# EAGLE design main board (EAGLE 7.7.0)
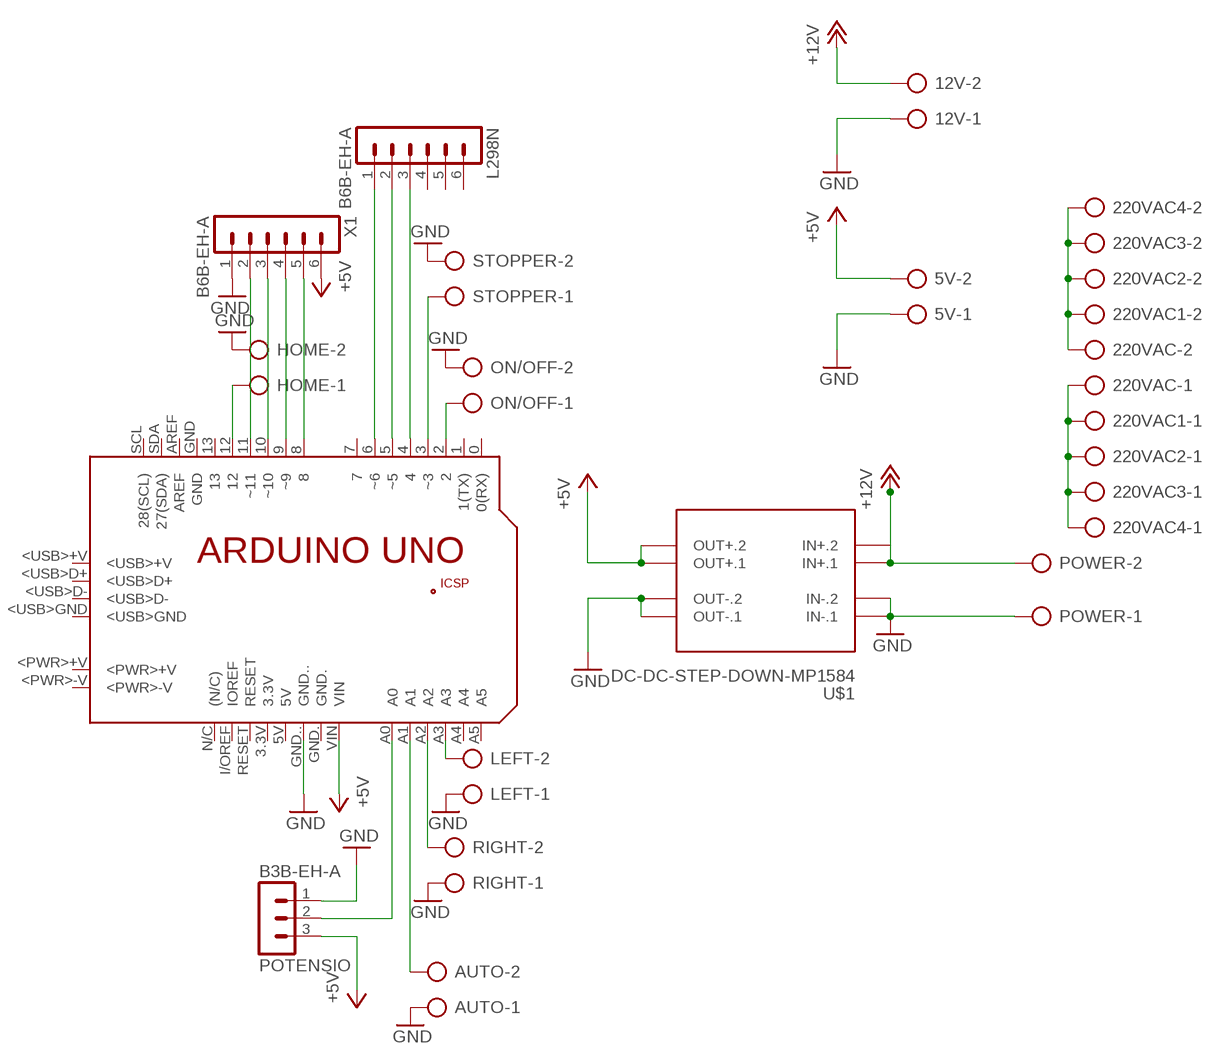
[diagram p0: schematic, sheet 1]

## Parts
5V  AK500/2-H  [AK500/2-H]
12V  AK500/2-H  [AK500/2-H]
220VAC  AK500/2-H  [AK500/2-H]
220VAC1  AK500/2-H  [AK500/2-H]
220VAC2  AK500/2-H  [AK500/2-H]
220VAC3  AK500/2-H  [AK500/2-H]
220VAC4  AK500/2-H  [AK500/2-H]
AUTO  AK500/2-H  [AK500/2-H]
HOME  AK500/2-H  [AK500/2-H]
L298N  B6B-EH-A  [B6B-EH-A]
LEFT  AK500/2-H  [AK500/2-H]
ON/OFF  AK500/2-H  [AK500/2-H]
PCB1  ARDUINO_UNO  [ARDUINO_UNO]
POTENSIO  B3B-EH-A  [B3B-EH-A]
POWER  AK500/2-H  [AK500/2-H]
RIGHT  AK500/2-H  [AK500/2-H]
STOPPER  AK500/2-H  [AK500/2-H]
U$1  DC-DC-STEP-DOWN-MP1584  [DC-DC-STEP-DOWN-MP1584]
X1  B6B-EH-A  [B6B-EH-A]

## Nets
+5V: 5V.2 PCB1.VIN POTENSIO.3 U$1.OUT+.1 U$1.OUT+.2 X1.6
+12V: 12V.2 POWER.2 U$1.IN+.1 U$1.IN+.2
GND: 5V.1 12V.1 AUTO.1 HOME.2 LEFT.1 ON/OFF.2 PCB1.GND.. POTENSIO.1 POWER.1 RIGHT.1 STOPPER.2 U$1.IN-.1 U$1.IN-.2 U$1.OUT-.1 U$1.OUT-.2 X1.1
N$1: L298N.2 PCB1.5(~5)
N$2: L298N.3 PCB1.4
N$3: L298N.1 PCB1.6(~6)
N$4: AUTO.2 PCB1.A1
N$5: PCB1.11(~11) X1.2
N$6: PCB1.A0 POTENSIO.2
N$9: PCB1.10(~10) X1.3
N$10: PCB1.9(~9) X1.4
N$11: PCB1.8 X1.5
N$12: PCB1.A2 RIGHT.2
N$13: LEFT.2 PCB1.A3
N$14: PCB1.3(~3) STOPPER.1
N$15: HOME.1 PCB1.12
N$16: ON/OFF.1 PCB1.2
N$17: 220VAC1.1 220VAC2.1 220VAC3.1 220VAC4.1 220VAC.1
N$18: 220VAC1.2 220VAC2.2 220VAC3.2 220VAC4.2 220VAC.2
Unconnected: L298N.4 L298N.5 L298N.6 PCB1.0(0(RX)) PCB1.1(1(TX)) PCB1.3.3V PCB1.5V PCB1.7 PCB1.13 PCB1.+5V PCB1.<PWR>+V PCB1.<PWR>-V PCB1.<USB>+V PCB1.<USB>D+ PCB1.<USB>D- PCB1.<USB>GND PCB1.A4 PCB1.A5 PCB1.AREF PCB1.GND PCB1.GND. PCB1.GND_ PCB1.I/OREF(IOREF) PCB1.MISO PCB1.MOSI PCB1.N/C((N/C)) PCB1.RESET PCB1.RESET. PCB1.SCK PCB1.SCL(28(SCL)) PCB1.SDA(27(SDA))

## Library data of the parts
5V 12V 220VAC 220VAC1-220VAC4 AUTO HOME LEFT ON/OFF POWER RIGHT STOPPER = con-ptr500:AK500/2-H: CONNECTOR Aug. 2004 / PTR Meßtechnik: Die Bezeichnung der Serie AK505 wurde geändert. Es handelt sich hierbei um AK500 in horizontaler Ausführung.; OC_FARNELL: unknown; OC_NEWARK: unknown
L298N X1 = con-JST EH:B6B-EH: JST EH series header 2.50mm pitch disconnectable crimp style connectors, vertical (side entry type), 6 pins
PCB1 = arduino:ARDUINO_UNO: Device for representing an Arduino Uno board with a footprint in an EAGLE design. Created by Dave Young for Element14. More EAGLE documentation at: http://www.element14.com/community/community/knode/cadsoft_eagle
POTENSIO = con-JST EH:B3B-EH: JST EH series header 2.50mm pitch disconnectable crimp style connectors, vertical (side entry type), 3 pins
U$1 = diy-modules:DC-DC-STEP-DOWN-MP1584: DC/DC Step-Down Regulator based on MP1584 chip MP1584 datasheet available here: http://www.haoyuelectronics.com/Attachment/MP1584/MP1584.pdf Click here to find device on ebay.com <http://www.ebay.com/sch/mp1584+module>

## Board
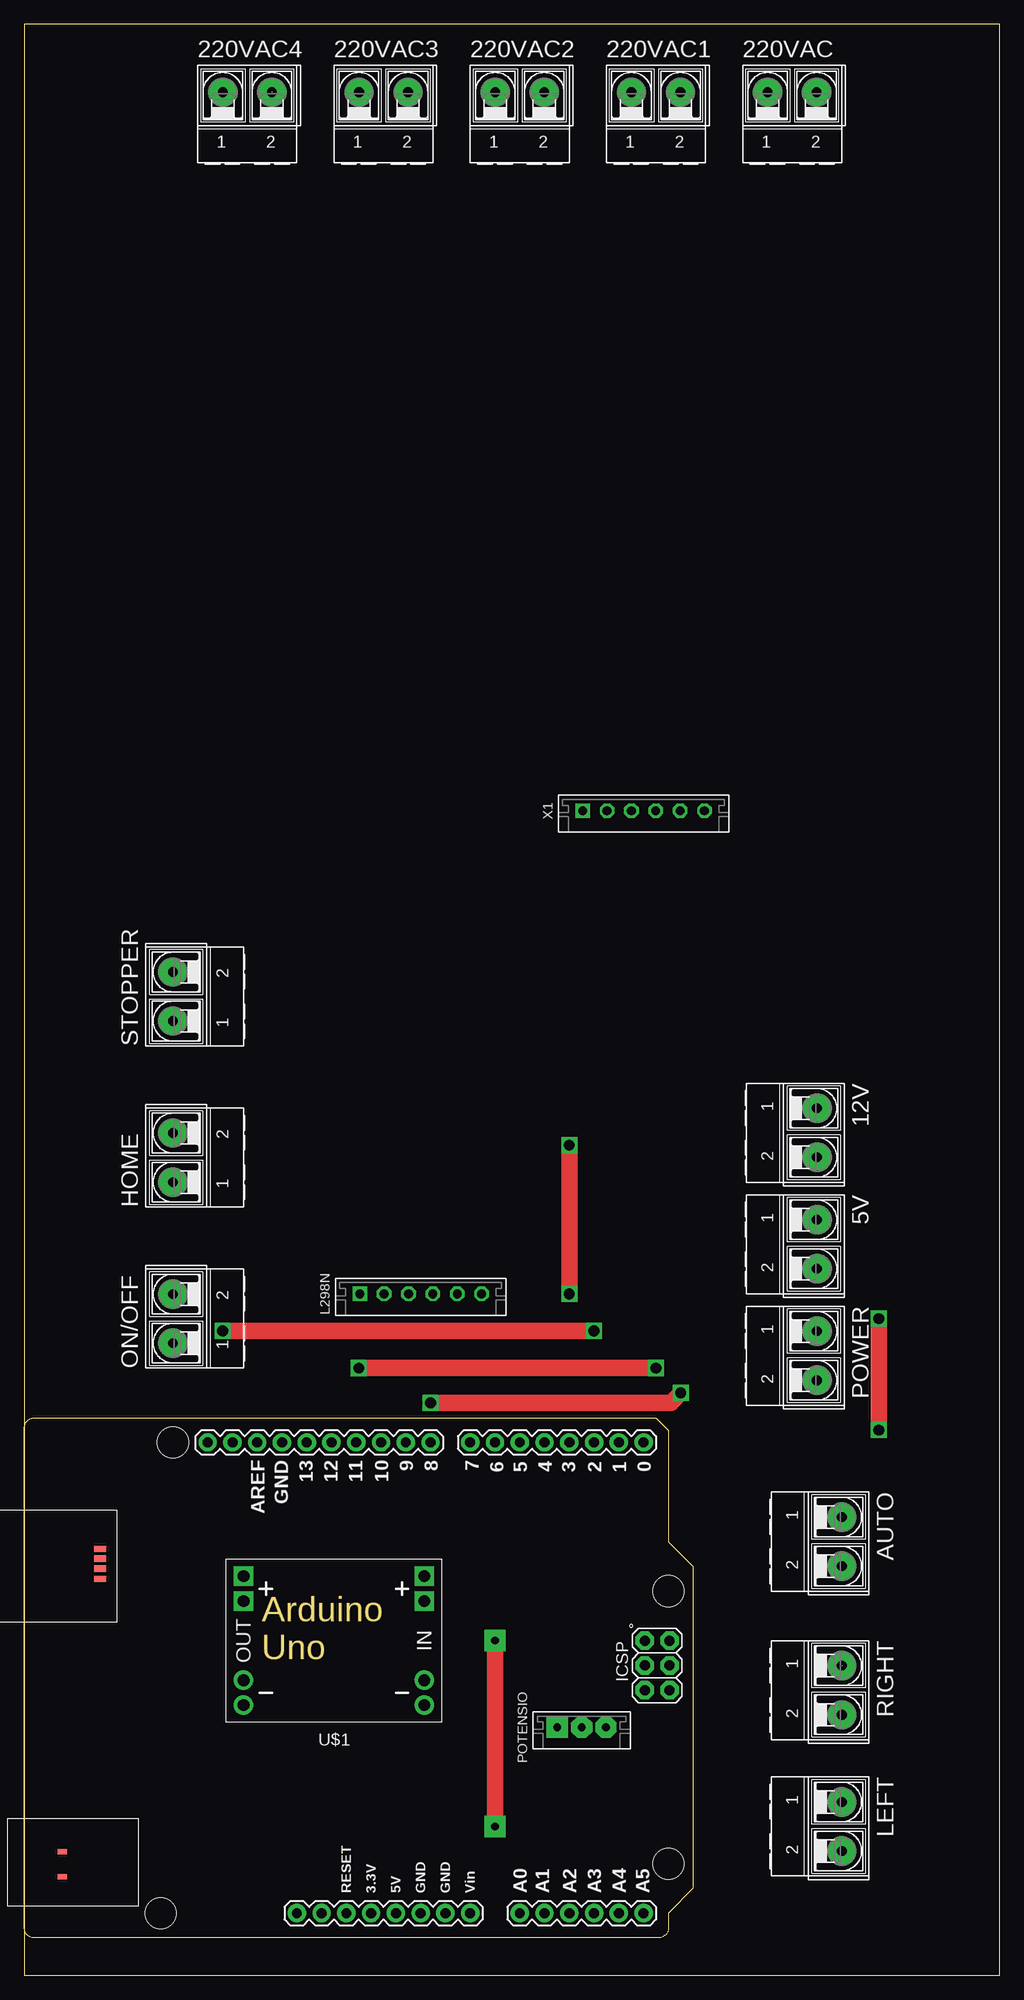
[diagram p1: board, top side]
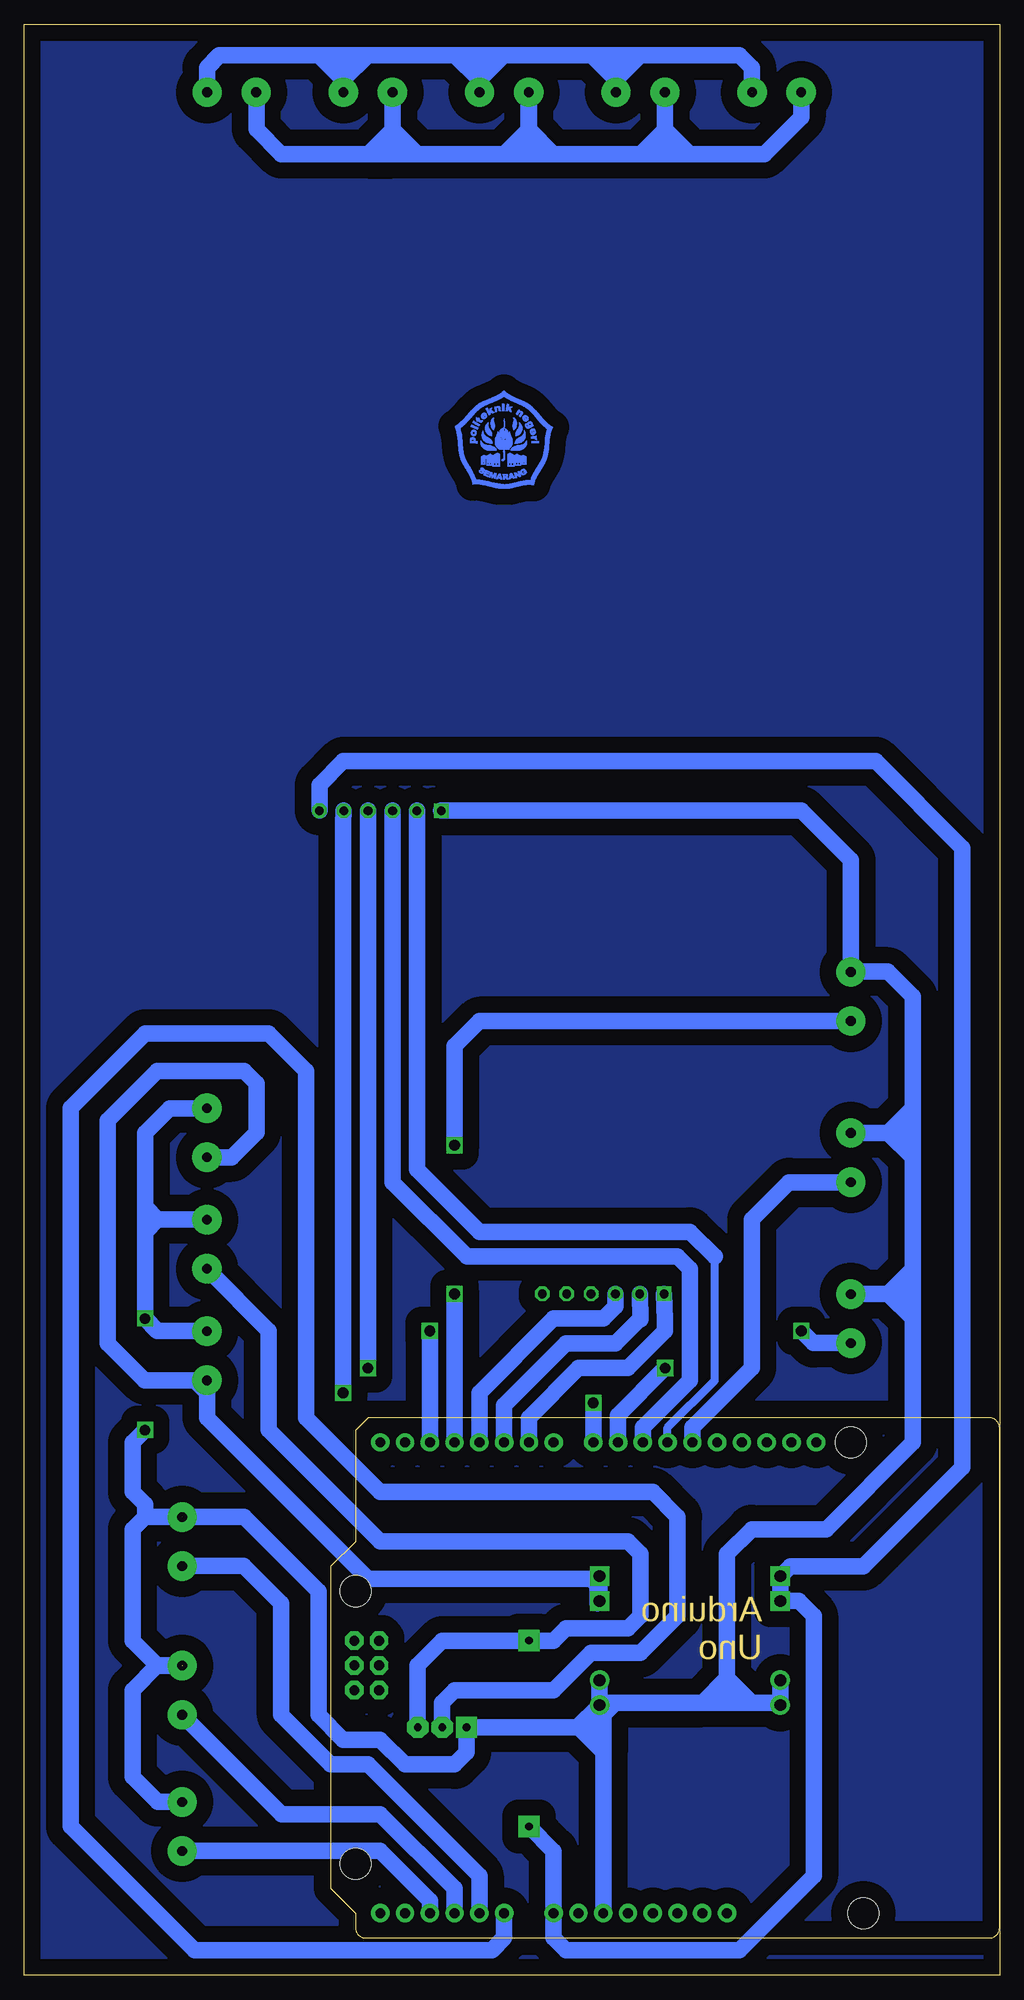
[diagram p2: board, bottom side, seen from below]

Size 100 x 200 mm. Coordinates in mm from the lower left corner, seen from the top.
Outline: 0,0 100,0 100,200 0,200 0,0
Copper layers (1*16): Top 0.035mm / dielectric 1.5mm / Bottom 0.035mm
Design rules "default": minimum track width 10mil, minimum drill 24mil, track to track 8mil, track to pad 8mil, pad to pad 8mil, via to via 8mil, smd to smd 8mil, copper to edge 40mil, drill to drill 8mil, minimum pad ring 10mil, minimum via ring 8mil, stop-mask expansion 4mil, vias tented up to drill 0mil, thermal gap 10mil

### Footprints (pad centres in the part's own frame; a part is rotated, then mirrored left to right if it is on the bottom)
AK500/2-H = drill 1 pad 3: 1 -2.515,0; 2 2.515,0
B6B-EH-A = drill 0.9 pad 1.5 square: 1 -6.25,0 | drill 0.9 pad 1.5 octagon: 2 -3.75,0; 3 -1.25,0; 4 1.25,0; 5 3.75,0; 6 6.25,0
ARDUINO_UNO = drill 1.016 pad 1.88: 0 63.5,50.8; 1 60.96,50.8; 2 58.42,50.8; 3 55.88,50.8; 3.3V 35.56,2.54; 4 53.34,50.8; 5 50.8,50.8; 5V 38.1,2.54; 6 48.26,50.8; 7 45.72,50.8; 8 41.656,50.8; 9 39.116,50.8; 10 36.576,50.8; 11 34.036,50.8; 12 31.496,50.8; 13 28.956,50.8; A0 50.8,2.54; A1 53.34,2.54; A2 55.88,2.54; A3 58.42,2.54; A4 60.96,2.54; A5 63.5,2.54; AREF 23.876,50.8; GND 26.416,50.8; GND. 43.18,2.54; GND.. 40.64,2.54; I/OREF 30.48,2.54; N/C 27.94,2.54; RESET 33.02,2.54; SCL 18.796,50.8; SDA 21.336,50.8; VIN 45.72,2.54 | drill 1.016 pad 1.88 octagon: +5V 66.167,30.48; GND_ 66.167,25.4; MISO 63.627,30.48; MOSI 66.167,27.94; RESET. 63.627,25.4; SCK 63.627,27.94 | smd 1.016 x 0.508: <PWR>+V 3.861,8.814; <PWR>-V 3.861,6.274 | smd 1.27 x 0.635: <USB>+V 7.772,39.878; <USB>D+ 7.772,38.887; <USB>D- 7.772,37.871; <USB>GND 7.772,36.83 | hole 3.2: 66.04,7.62; 66.04,35.56; 15.24,50.8; 13.97,2.54
B3B-EH-A = drill 0.8 pad 2.184 square: 1 -2.5,0 | drill 0.8 pad 2.184 octagon: 2 0,0; 3 2.5,0
DC-DC-STEP-DOWN-MP1584 = drill 1.2 pad 2 square: IN+.1 -9.271,-4.064; IN+.2 -9.271,-6.604; OUT+.1 9.271,-4.064; OUT+.2 9.271,-6.604 | drill 1.2 pad 2: IN-.1 -9.271,6.604; IN-.2 -9.271,4.064; OUT-.1 9.271,6.604; OUT-.2 9.271,4.064

### Placement (x,y rotation side)
5V  81.28,74.93 270 top
12V  81.28,86.36 270 top
220VAC  78.74,193.04 0 top
220VAC1  64.77,193.04 0 top
220VAC2  50.8,193.04 0 top
220VAC3  36.83,193.04 0 top
220VAC4  22.86,193.04 0 top
AUTO  83.82,44.45 270 top
HOME  15.24,83.82 90 top
L298N  40.64,69.85 0 top
LEFT  83.82,15.24 270 top
ON/OFF  15.24,67.31 90 top
PCB1  0,3.81 0 top
POTENSIO  57.15,25.4 0 top
POWER  81.28,63.5 270 top
RIGHT  83.82,29.21 270 top
STOPPER  15.24,100.33 90 top
U$1  31.75,34.29 180 top
U$2  [POLINES_10X10_BOT]  50.8,157.48 0 top
X1  63.5,119.38 0 top

### Tracks (layer width: path | path; a pad name or v marks a point on that pad's centre or on a via)
+5V  (via drill 0.8 pad 2.18)
  Top 1.676: v48.26,15.24 v48.26,34.29
  Bottom 1.676: v48.26,15.24 45.72,12.7 PCB1.VIN 45.72,3.81 44.45,2.54 26.67,2.54 19.05,10.16 19.05,36.83 20.57,38.35 U$1.OUT+.1 U$1.OUT+.2 21.46,41.91 13.97,41.91 3.81,52.07 3.81,115.57 12.7,124.46 67.31,124.46 69.75,122.02 X1.6 | POTENSIO.3 59.69,25.44 59.69,31.75 57.15,34.29 v48.26,34.29 45.72,34.29 44.45,35.56 38.1,35.56 36.83,36.83 36.83,43.18 38.1,44.45 63.5,44.45 74.93,55.88 74.93,66.06 5V.2 81.25,72.39
+12V
  Bottom 1.676: U$1.IN+.2 U$1.IN+.1 41.25,38.12 41.25,39.98 41.91,40.64 64.77,40.64 81.28,57.15 81.28,59.69 82.55,60.96 81.31,60.96 POWER.2 87.66,60.98 91.44,64.77 91.44,87.63 86.36,92.71 77.47,92.71 76.2,91.44 76.2,86.39 78.74,83.84 12V.2
GND  (via drill 1.1 pad 0.8)  (2 unrouted)
  Top 1.676: v87.63,55.88 v87.63,67.31
  Bottom 0.254: 81.28,77.47 5V.1 | 81.92,66.04 POWER.1
  Bottom 1.676: 12V.1 85.11,88.88 87.63,86.36 87.63,78.74 | 87.63,78.74 86.36,77.47 | 81.28,77.47 86.36,77.47 | 81.28,66.04 81.92,66.04 86.36,66.04 v87.63,67.31 87.63,76.2 | U$1.IN-.2 U$1.IN-.1 | U$1.OUT-.1 U$1.OUT-.2 22.48,28.32 22.86,27.94 25.4,27.94 | 39.37,27.94 40.64,27.94 | 40.64,27.94 40.77,27.94 U$1.IN-.1 | 40.64,26.67 40.64,27.3 | 40.64,27.3 U$1.IN-.1 | PCB1.GND.. 40.64,22.86 | 40.64,25.4 40.64,26.67 | 87.63,76.2 87.63,78.74 | 81.25,66.04 POWER.1 | 27.94,27.94 30.48,27.94 | 39.37,27.94 40.64,26.67 | POTENSIO.1 43.31,25.4 U$1.IN-.1 | 40.64,25.4 43.18,25.4 40.64,22.86 | 40.64,25.4 40.64,22.86 | POTENSIO.1 41.91,25.4 40.64,26.67 | 40.64,27.3 40.64,27.94 | 39.37,27.94 30.48,27.94 | 30.48,27.94 27.94,30.48 | 27.94,30.48 27.94,43.18 25.4,45.72 17.78,45.72 8.89,54.61 8.89,67.31 | 8.89,67.31 11.43,69.85 | ON/OFF.2 15.21,69.85 11.43,69.85 | 11.43,69.85 8.89,72.39 | 8.89,72.39 8.89,83.82 | 8.89,83.82 11.43,86.36 15.21,86.36 HOME.2 11.46,86.33 8.89,88.9 | 8.89,88.9 8.89,100.33 11.43,102.87 15.21,102.87 | 15.24,102.87 15.21,102.87 | 15.21,102.87 STOPPER.2 15.24,114.3 20.32,119.38 X1.1 | 8.89,83.82 8.89,87.63 | 8.89,88.9 8.89,87.63 | 8.89,87.63 10.16,86.36 | 8.89,72.39 8.89,68.58 | 8.89,67.31 8.89,68.58 | 8.89,68.58 10.16,69.85 | 27.94,30.48 25.4,27.94 | 25.4,27.94 27.94,27.94 | 27.94,27.94 27.94,30.48 | LEFT.1 86.33,17.75 88.9,20.32 88.9,29.21 86.36,31.75 83.82,31.75 | RIGHT.1 86.33,31.73 88.9,34.29 88.9,45.72 87.63,46.99 | 87.63,46.99 83.82,46.99 | POTENSIO.1 54.65,22.82 55.88,21.59 60.96,21.59 63.5,24.13 67.31,24.13 69.85,26.67 69.85,39.37 77.47,46.99 83.8,46.99 AUTO.1 | 87.63,46.99 87.63,48.26 88.9,49.53 88.9,54.61 v87.63,55.88
  Bottom 1.676: 87.63,76.2 86.36,77.47
N$1
  Bottom 1.676: PCB1.5 50.8,58.42 44.45,64.77 39.37,64.77 36.83,67.31 36.83,67.25 L298N.2
N$2
  Bottom 1.676: PCB1.4 53.34,59.69 45.72,67.31 40.64,67.31 39.37,68.58 39.37,69.83 L298N.3
N$3
  Bottom 1.676: PCB1.6 48.26,57.15 43.18,62.23 38.1,62.23 34.29,66.04 34.29,67.21 L298N.1
N$4
  Bottom 1.676: AUTO.2 77.5,41.94 73.66,38.1 73.66,26.67 68.58,21.59 64.77,21.59 53.34,10.16 PCB1.A1
N$5
  Bottom 0.813: PCB1.11 34.04,56.13 29.21,60.96 29.21,73.66
  Bottom 1.676: X1.2 59.75,82.61 53.34,76.2 31.75,76.2 29.21,73.66
N$6
  Bottom 1.676: POTENSIO.2 57.15,27.94 55.88,29.21 45.72,29.21 41.91,33.02 36.83,33.02 33.02,36.83 33.02,46.99 35.56,49.53 63.5,49.53 71.12,57.15 71.12,92.71 74.93,96.52 87.63,96.52 95.25,88.9 95.25,15.24 82.55,2.54 52.07,2.54 50.8,3.81 PCB1.A0
N$8
  pour Bottom (isolate 1.676): 0,199.39 100.33,199.39 100.33,-1.27 0,-1.27
N$9
  Bottom 1.676: PCB1.10 36.58,56.13 31.75,60.96 31.75,72.39 33.02,73.66 54.61,73.66 62.23,81.28 62.23,119.36 X1.3
N$10  (via drill 1.1 pad 0.8)
  Top 1.676: v34.29,62.23 v64.77,62.23
  Bottom 1.676: PCB1.9 39.12,57.4 v34.29,62.23 | v64.77,62.23 64.77,119.36 X1.4
N$11  (via drill 1.1 pad 0.8)
  Top 1.676: v41.66,58.67 66.29,58.67 v67.31,59.69
  Bottom 1.676: PCB1.8 v41.66,58.67 | v67.31,59.69 67.31,118.05 X1.5
N$12
  Bottom 1.676: PCB1.A2 55.88,8.89 63.5,16.51 73.64,16.51 RIGHT.2
N$13
  Bottom 1.676: LEFT.2 63.52,12.72 58.42,7.62 PCB1.A3
N$14  (via drill 1.1 pad 0.8)
  Top 1.676: v55.88,85.09 v55.88,69.85
  Bottom 1.676: STOPPER.1 53.31,97.81 55.88,95.25 v55.88,85.09 | v55.88,69.85 PCB1.3
N$15
  Bottom 1.676: PCB1.12 31.5,56.13 25.4,62.23 25.4,77.47 21.59,81.28 15.27,81.28 HOME.1
N$16  (via drill 1.1 pad 0.8)
  Top 1.676: v20.32,66.04 v58.42,66.04
  Bottom 1.676: ON/OFF.1 19.07,64.8 v20.32,66.04 | v58.42,66.04 PCB1.2
N$17
  Bottom 1.676: 220VAC4.1 20.34,190.47 24.13,186.69 31.75,186.69 | 31.75,186.69 34.29,189.23 34.29,193.01 220VAC3.1 34.31,189.21 36.83,186.69 45.72,186.69 48.26,189.23 48.26,193.01 220VAC2.1 48.28,189.21 50.8,186.69 59.69,186.69 62.23,189.23 | 62.23,189.23 62.23,193.01 220VAC1.1 62.26,189.21 64.77,186.69 | 64.77,186.69 73.66,186.69 76.2,189.23 76.2,193.01 220VAC.1 | 64.77,186.69 62.23,186.69 | 31.75,186.69 34.29,186.69 | 34.29,187.96 34.29,186.69 | 34.29,186.69 48.26,186.69 | 48.26,187.96 48.26,186.69 | 48.26,186.69 62.23,186.69 | 62.23,186.69 62.23,189.23
N$18  (1 unrouted)
  Bottom 1.676: 220VAC3.2 39.34,194.34 | 39.34,194.34 36.83,196.85 | 36.83,196.85 26.67,196.85 25.4,195.58 25.4,193.04 | 50.8,196.85 53.31,194.34 220VAC2.2 53.31,194.28 53.34,194.31 | 50.8,196.85 41.86,196.85 | 41.86,196.85 39.34,194.34 | 53.34,194.31 55.88,196.85 | 55.88,196.85 64.77,196.85 | 64.77,196.85 67.31,194.31 67.31,193.06 220VAC1.2 67.28,194.28 69.85,196.85 | 69.85,196.85 80.01,196.85 81.28,195.58 81.28,193.06 220VAC.2 | 36.83,196.85 39.37,196.85 | 39.37,196.85 41.86,196.85 | 39.37,196.85 39.37,195.58 | 50.8,196.85 53.34,196.85 | 55.88,196.85 53.34,196.85 | 53.34,196.85 53.34,194.31 | 64.77,196.85 67.31,196.85 | 69.85,196.85 67.31,196.85 | 67.31,196.85 67.31,195.58